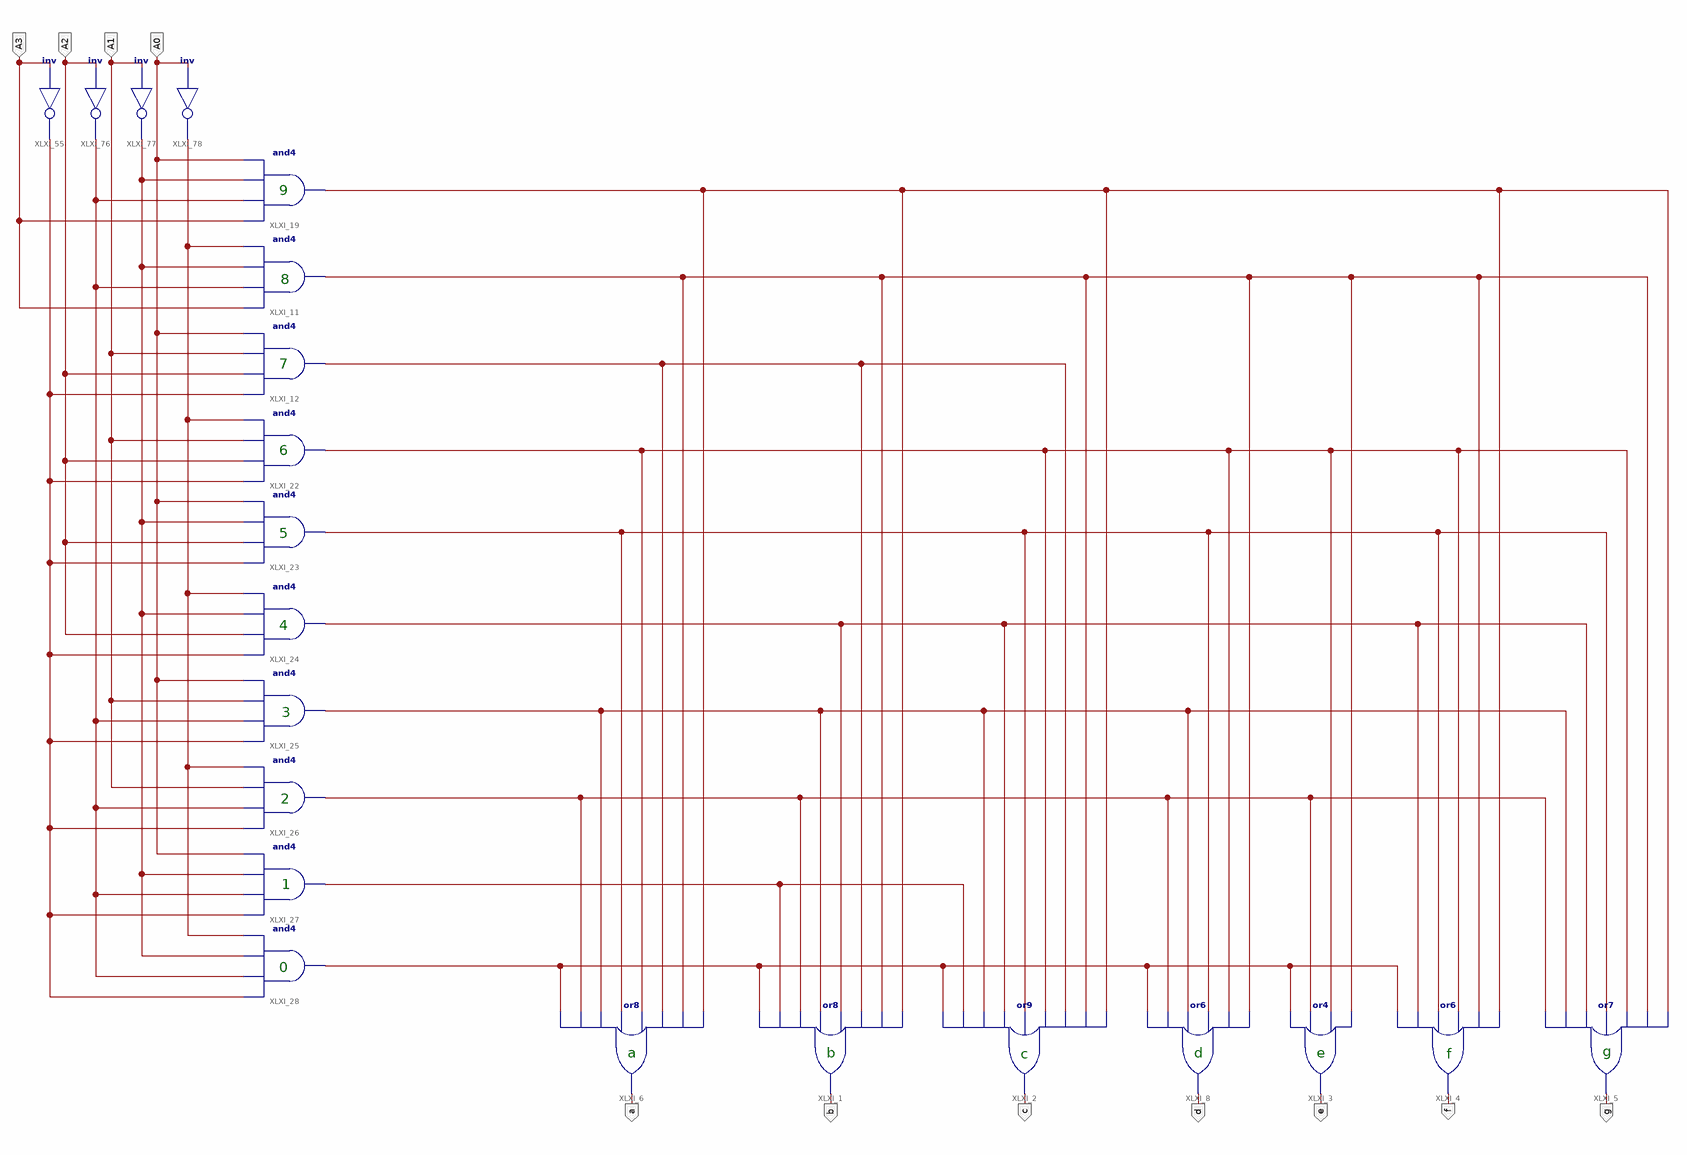
[diagram p0: schematic sheet 1]
// Xilinx ISE schematic BCD_7SEG.sch (spartan3) as structural Verilog: 21 symbols, 11 ports
module BCD_7SEG (
  input  A3,
  input  A2,
  input  A0,
  input  A1,
  output a,
  output b,
  output c,
  output d,
  output e,
  output f,
  output g
);

  wire XLXN_3, XLXN_4, XLXN_7, XLXN_8, XLXN_54, XLXN_61, XLXN_63, XLXN_68, XLXN_73, XLXN_78, XLXN_83,
       XLXN_89, XLXN_92, XLXN_104;

  or XLXI_1 (b, XLXN_54, XLXN_61, XLXN_63, XLXN_68, XLXN_73, XLXN_89, XLXN_92, XLXN_104);
  or XLXI_2 (c, XLXN_54, XLXN_61, XLXN_68, XLXN_73, XLXN_78, XLXN_83, XLXN_89, XLXN_92, XLXN_104);
  or XLXI_3 (e, XLXN_54, XLXN_63, XLXN_83, XLXN_92);
  or XLXI_4 (f, XLXN_54, XLXN_73, XLXN_78, XLXN_83, XLXN_92, XLXN_104);
  or XLXI_5 (g, XLXN_63, XLXN_68, XLXN_73, XLXN_78, XLXN_83, XLXN_92, XLXN_104);
  or XLXI_6 (a, XLXN_54, XLXN_63, XLXN_68, XLXN_78, XLXN_83, XLXN_89, XLXN_92, XLXN_104);
  not XLXI_55 (XLXN_8, A3);
  not XLXI_76 (XLXN_7, A2);
  not XLXI_77 (XLXN_4, A1);
  not XLXI_78 (XLXN_3, A0);
  and XLXI_11 (XLXN_92, A3, XLXN_7, XLXN_4, XLXN_3);
  and XLXI_12 (XLXN_89, XLXN_8, A2, A1, A0);
  and XLXI_22 (XLXN_83, XLXN_8, A2, A1, XLXN_3);
  and XLXI_23 (XLXN_78, XLXN_8, A2, XLXN_4, A0);
  and XLXI_24 (XLXN_73, XLXN_8, A2, XLXN_4, XLXN_3);
  and XLXI_25 (XLXN_68, XLXN_8, XLXN_7, A1, A0);
  and XLXI_26 (XLXN_63, XLXN_8, XLXN_7, A1, XLXN_3);
  and XLXI_27 (XLXN_61, XLXN_8, XLXN_7, XLXN_4, A0);
  and XLXI_28 (XLXN_54, XLXN_8, XLXN_7, XLXN_4, XLXN_3);
  and XLXI_19 (XLXN_104, A3, XLXN_7, XLXN_4, A0);
  or XLXI_8 (d, XLXN_54, XLXN_63, XLXN_68, XLXN_78, XLXN_83, XLXN_92);

  // Notes on the sheet:
  //   9
  //   8
  //   7
  //   6
  //   5
  //   4
  //   3
  //   2
  //   1
  //   0
  //   g
  //   a
  //   b
  //   d
  //   e
  //   c
  //   f
endmodule
